# Altium project EVK-NORA-W1.PrjPcb (part 1 of 3)
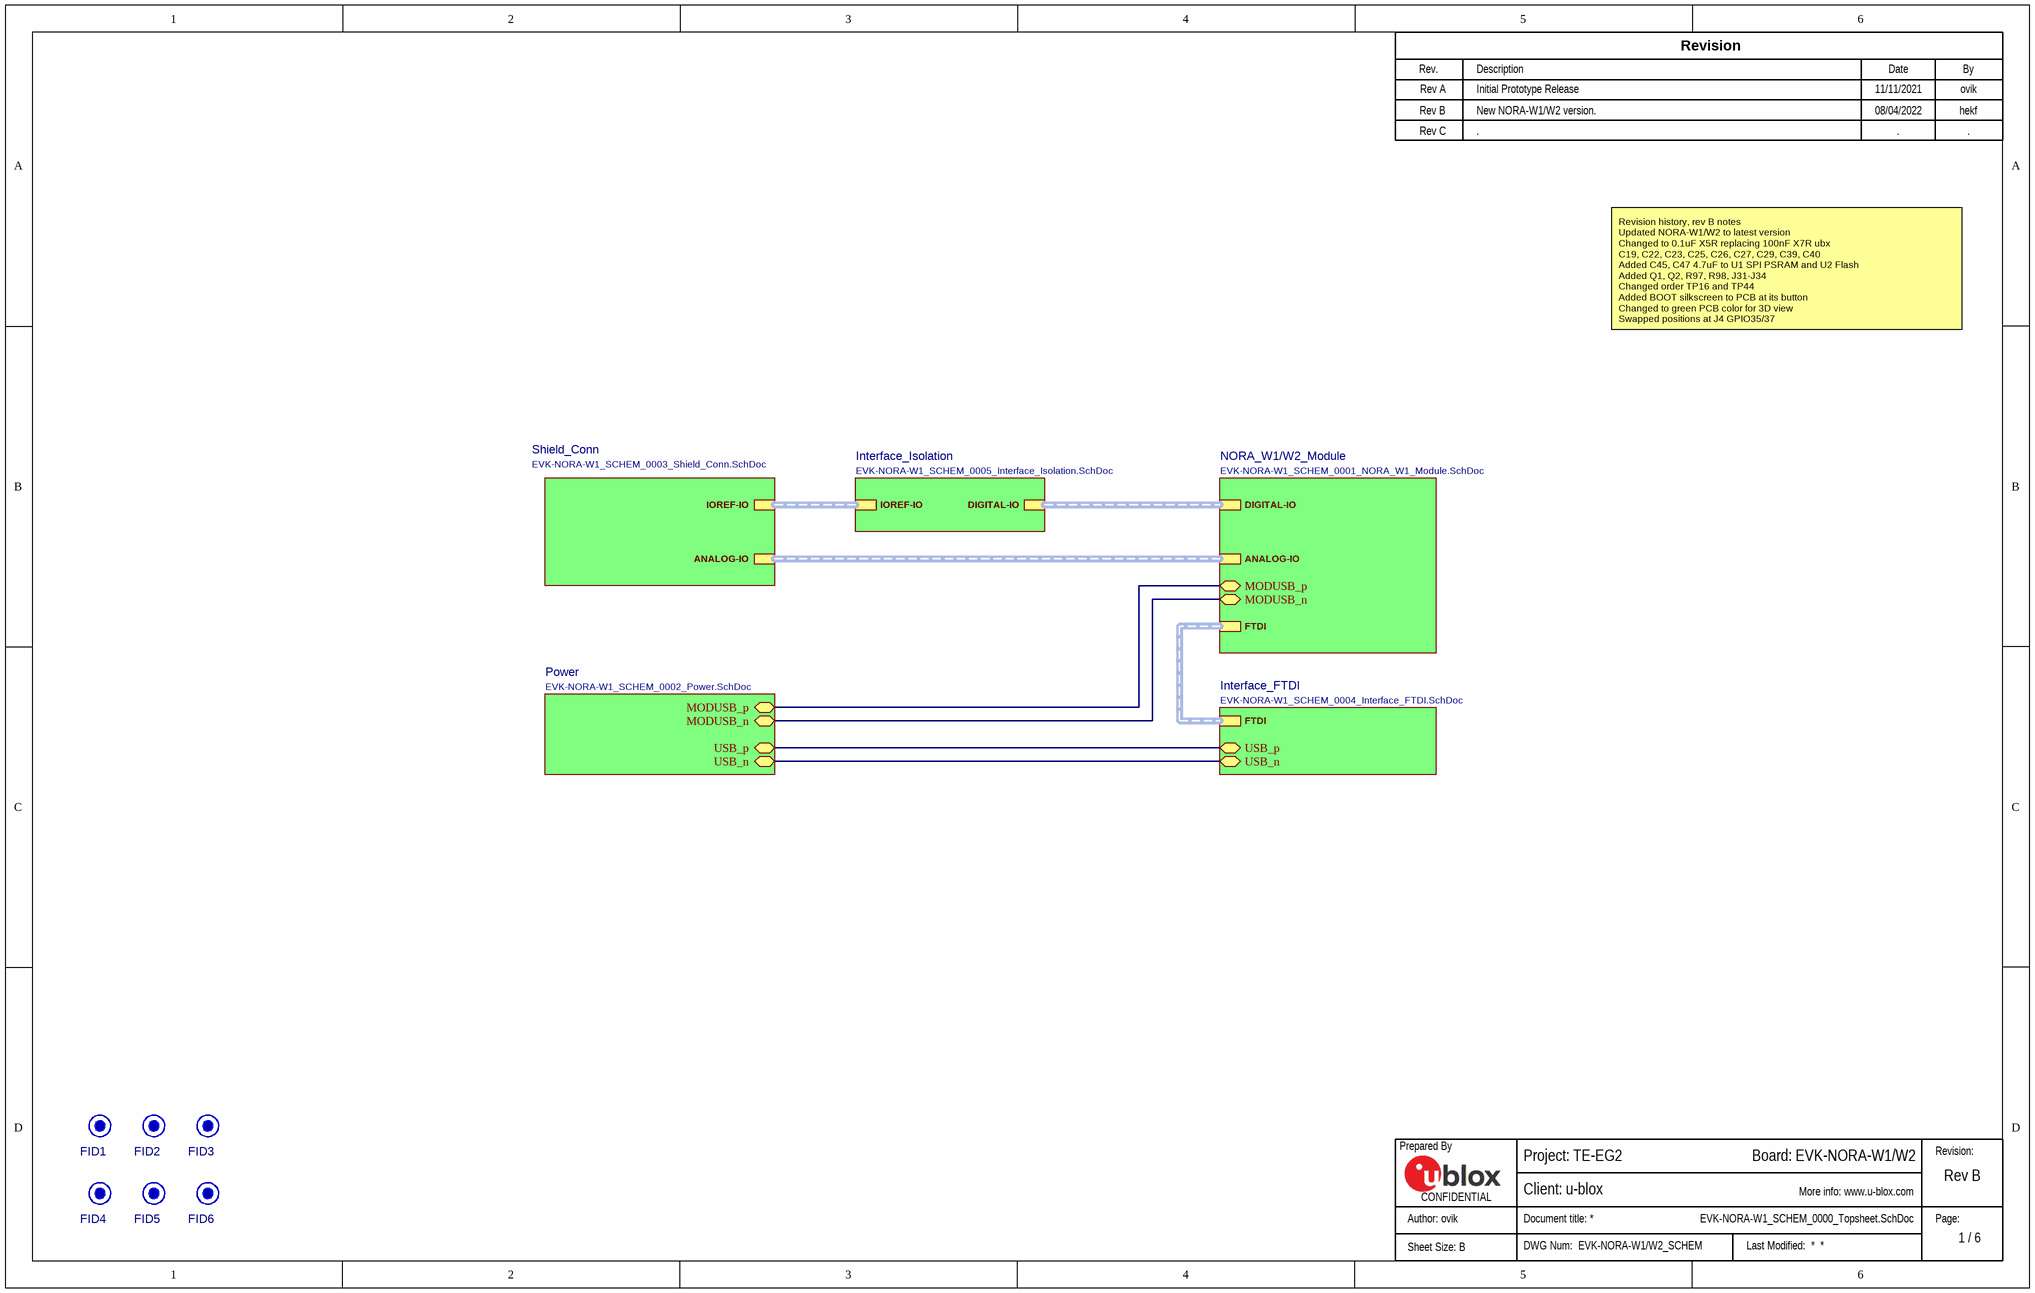
[diagram p0: EVK-NORA-W1_SCHEM_0000_Topsheet.SchDoc]
SchSheetTotal: 6; SchDocNum: EVK-NORA-W1/W2_SCHEM; ReleaseRev5: Rev E; ReleaseRev4: Rev D; ReleaseRev3: Rev C; ReleaseRev2: Rev B; ReleaseRev1: Rev A; ReleaseDesc5: not done; ReleaseDesc4: .; ReleaseDesc3: .; ReleaseDesc2: New NORA-W1/W2 version.; ReleaseDesc1: Initial Prototype Release; ReleaseDate5: .; ReleaseDate4: .; ReleaseDate3: .; ReleaseDate2: 08/04/2022; ReleaseDate1: 11/11/2021; ReleaseBy5: .; ReleaseBy4: .; ReleaseBy3: .; ReleaseBy2: hekf; ReleaseBy1: ovik; ProjectEngineer: ovik; PCBName: EVK-NORA-W1/W2; PCBDocNum: UBXH60-0000895; GlobalReleaseDate: 08/04/2022; GlobalProjectTeam: u-blox AG; GlobalProjectRevision: Rev B; GlobalProjectName: TE-EG2; GlobalProjectLink: www.u-blox.com; GlobalClientName: u-blox
6 sheets, 310 parts. Net scope: flat (ports and power ports of the same name join across sheets).
Board file: EVK-NORA-W1.PcbDoc
Sheets:
  EVK-NORA-W1_SCHEM_0000_Topsheet.SchDoc
    NORA_W1/W2_Module = EVK-NORA-W1_SCHEM_0001_NORA_W1_Module.SchDoc
    Interface_FTDI = EVK-NORA-W1_SCHEM_0004_Interface_FTDI.SchDoc
    Shield_Conn = EVK-NORA-W1_SCHEM_0003_Shield_Conn.SchDoc
    Interface_Isolation = EVK-NORA-W1_SCHEM_0005_Interface_Isolation.SchDoc
    Power = EVK-NORA-W1_SCHEM_0002_Power.SchDoc

## Sheet EVK-NORA-W1_SCHEM_0000_Topsheet.SchDoc
size B; Date: 7/24/2020; CompanyName: U-Blox; DrawnBy: EMOO; Engineer: EMOO; Organization: U-Blox; Address1: 3950 Fairview Industrial Dr SE #100; Address2: Salem, OR 97302; SheetNumber: 1; SheetTotal: 6; SheetSize: B; SheetTitle: TopSheet

### Parts
(Parts that share a designator on the sheet are numbered #1, #2 ... from top to bottom, then left to right.)
?#1  (no value)  (graphical)
?#2  (no value)  (graphical)
FID1  FID  [FIDUCIAL40]  (value not drawn)  (no BOM)
FID2  FID  [FIDUCIAL40]  (value not drawn)  (no BOM)
FID3  FID  [FIDUCIAL40]  (value not drawn)  (no BOM)
FID4  FID  [FIDUCIAL40]  (value not drawn)  (no BOM)
FID5  FID  [FIDUCIAL40]  (value not drawn)  (no BOM)
FID6  FID  [FIDUCIAL40]  (value not drawn)  (no BOM)

### Sub-sheets
Interface_FTDI = EVK-NORA-W1_SCHEM_0004_Interface_FTDI.SchDoc: FTDI (harness FTDI), USB_p (bidir), USB_n (bidir)
Interface_Isolation = EVK-NORA-W1_SCHEM_0005_Interface_Isolation.SchDoc: DIGITAL-IO (harness DIGITAL-IO), IOREF-IO (harness IOREF-IO)
NORA_W1/W2_Module = EVK-NORA-W1_SCHEM_0001_NORA_W1_Module.SchDoc: FTDI (harness FTDI), DIGITAL-IO (harness DIGITAL-IO), ANALOG-IO (harness ANALOG-IO), MODUSB_p (bidir), MODUSB_n (bidir)
Power = EVK-NORA-W1_SCHEM_0002_Power.SchDoc: USB_p (bidir), MODUSB_p (bidir), MODUSB_n (bidir), USB_n (bidir)
Shield_Conn = EVK-NORA-W1_SCHEM_0003_Shield_Conn.SchDoc: IOREF-IO (harness IOREF-IO), ANALOG-IO (harness ANALOG-IO)

### Nets
(unnamed): sheet NORA_W1/W2_Module/MODUSB_p, sheet Power/MODUSB_p
(unnamed): sheet NORA_W1/W2_Module/MODUSB_n, sheet Power/MODUSB_n
(unnamed): sheet Interface_FTDI/USB_p, sheet Power/USB_p
(unnamed): sheet Interface_FTDI/USB_n, sheet Power/USB_n

### Buses and harness runs
harness sheet Interface_FTDI/FTDI = sheet NORA_W1/W2_Module/FTDI
harness sheet Interface_Isolation/DIGITAL-IO = sheet NORA_W1/W2_Module/DIGITAL-IO
harness sheet Interface_Isolation/IOREF-IO = sheet Shield_Conn/IOREF-IO
harness sheet NORA_W1/W2_Module/ANALOG-IO = sheet Shield_Conn/ANALOG-IO

### Notes on the sheet
- Revision history, rev B notes
  Updated NORA-W1/W2 to latest version
  Changed to 0.1uF X5R replacing 100nF X7R ubx
  C19, C22, C23, C25, C26, C27, C29, C39, C40
  Added C45, C47 4.7uF to U1 SPI PSRAM and U2 Flash
  Added Q1, Q2, R97, R98, J31-J34
  Changed order TP16 and TP44
  Added BOOT silkscreen to PCB at its button
  Changed to green PCB color for 3D view
  Swapped positions at J4 GPIO35/37
- Rev.
- Description
- Revision
- Date
- By
- Prepared By
- Revision:
- CONFIDENTIAL
- Page:

### Library data of the parts
?#1 = Top_Revision_Block: Release Revision History Block
?#2 = Top_Title_Block: Top level schematic title block for top level sheet
FID1-FID6 = FIDUCIAL.04: Fiducial, 0.040" inner Dia, 0.075" outer Dia; Added By: Jeremy D; Part Number: FIDUCIAL.04; Size: 0.040"; Height: 0; DNP: DNP; Added Date: 2/1/2015; Checked By: Paul B; Checked Date: 2/5/2015

## Sheet EVK-NORA-W1_SCHEM_0001_NORA_W1_Module.SchDoc: UBX_NORA_B1_SCHEM_0001_NORA_B1_Module
size B; Date: 7/24/2020; CompanyName: U-blox; DrawnBy: EMOO; Engineer: EMOO; Organization: U-blox; Address1: 3950 Fairview Industrial Dr SE #100; Address2: Salem, OR 97302; SheetNumber: 3; SheetTotal: 6; Website: www.u-blox.com; SheetSize: B
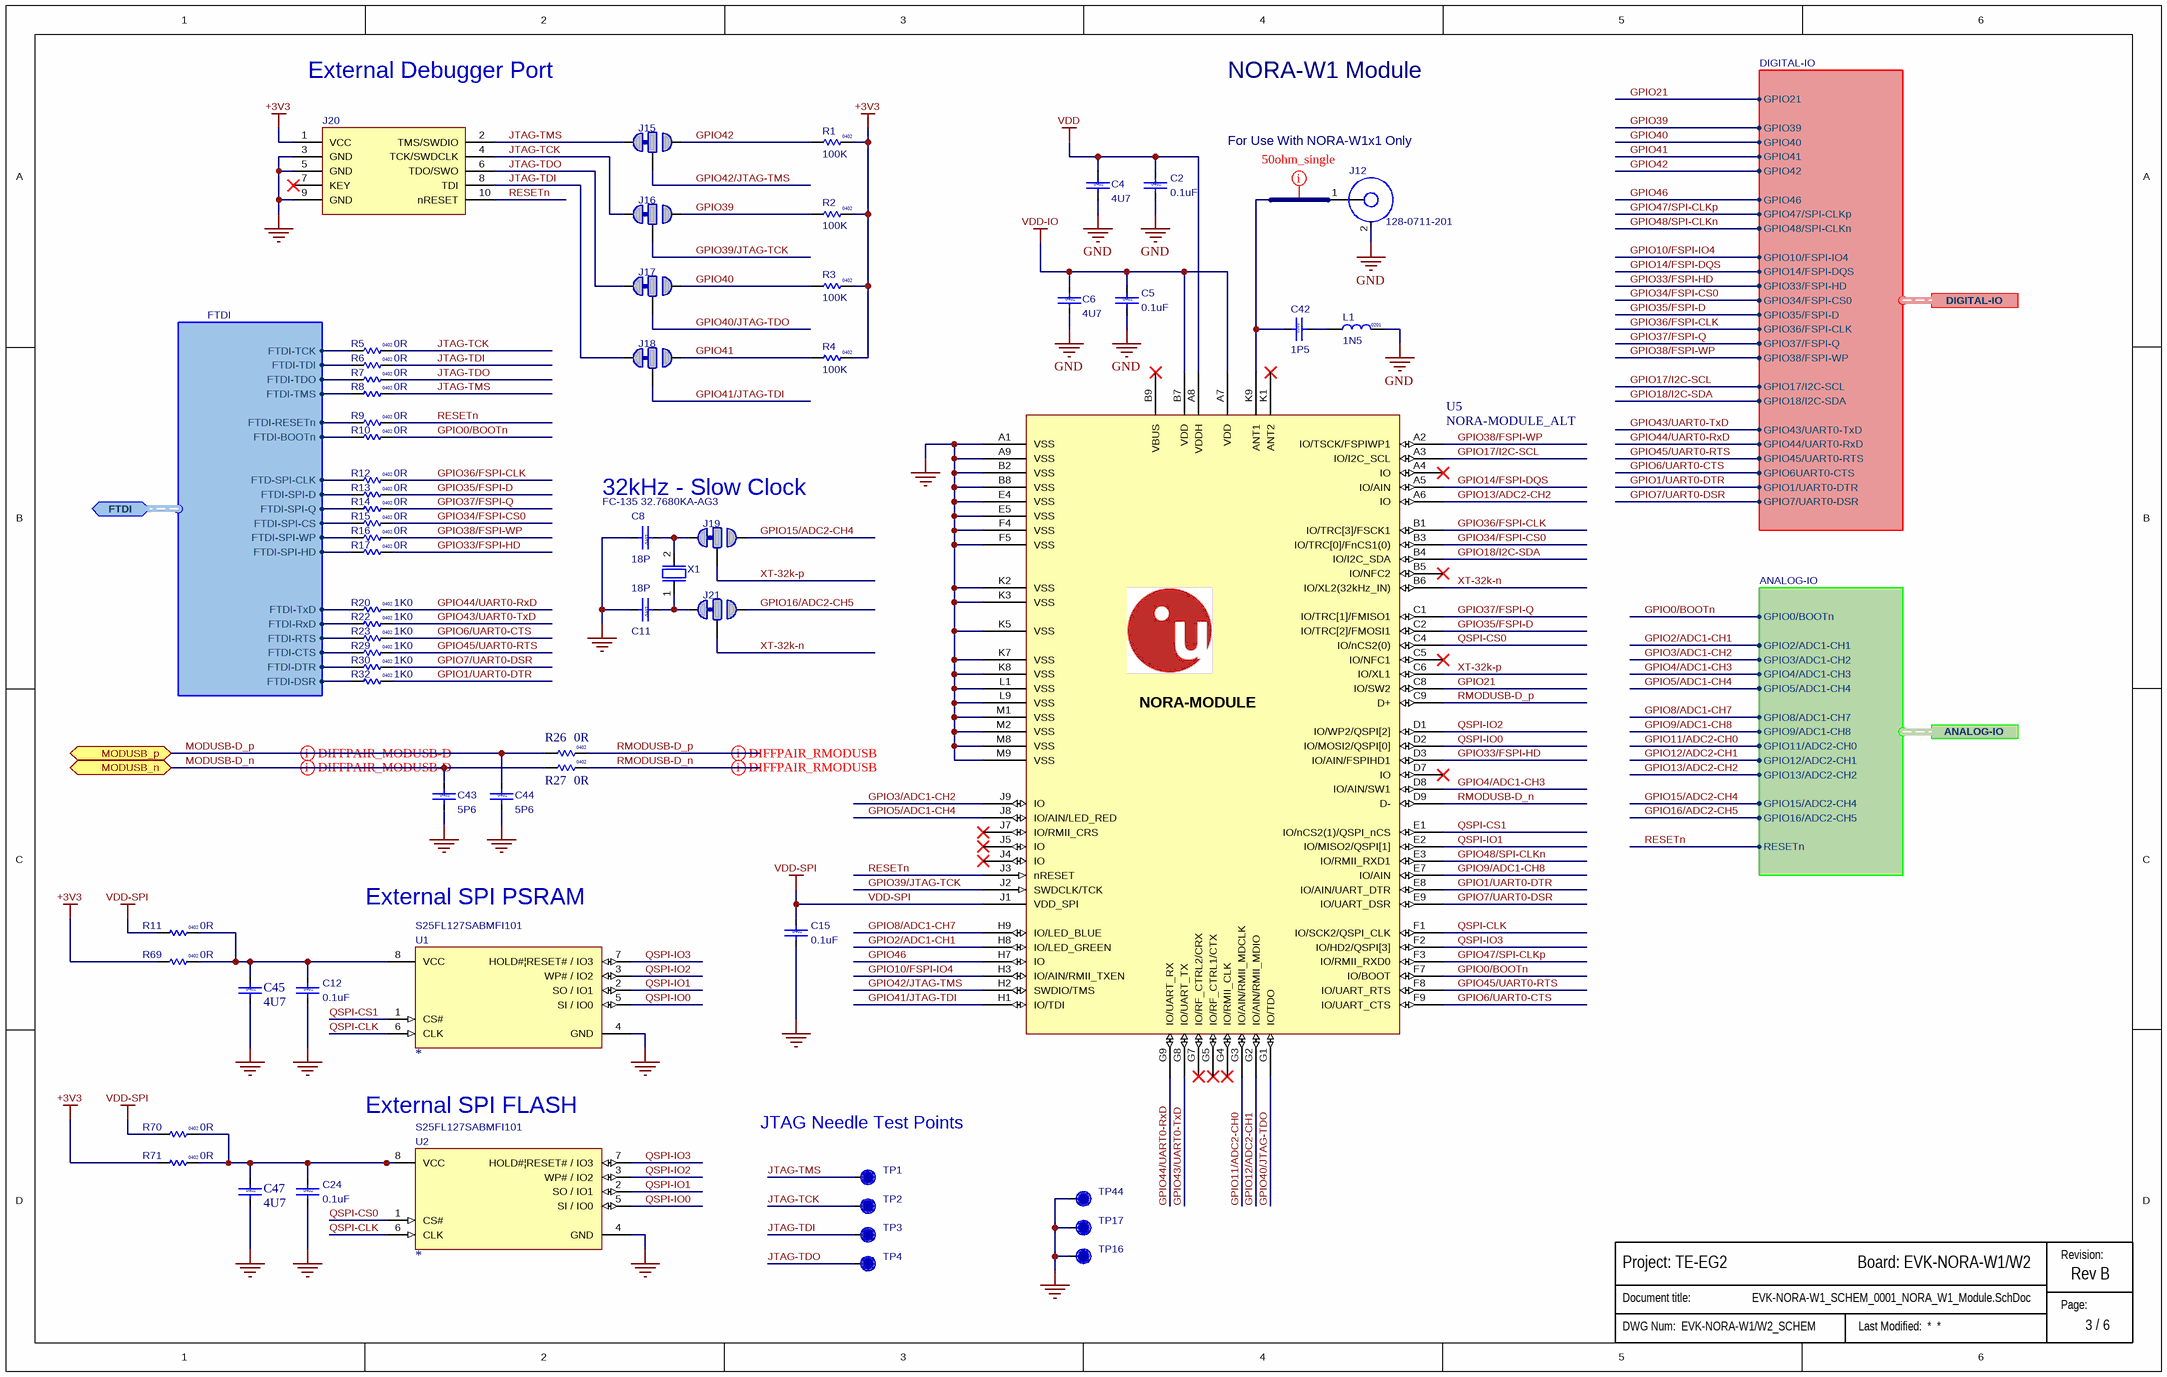
[diagram p1: EVK-NORA-W1_SCHEM_0001_NORA_W1_Module.SchDoc]

### Parts
(Parts that share a designator on the sheet are numbered #1, #2 ... from top to bottom, then left to right.)
?#3  (no value)  (graphical)
C2  value 0.1uF  Size: 0402  [Cap 0402 HD]  (hidden comment: 120-000160.1uF)
C4  value 4U7  Size: 0402  [Cap 0402 HD]
C5  value 0.1uF  Size: 0402  [Cap 0402 HD]  (hidden comment: 120-000160.1uF)
C6  value 4U7  Size: 0402  [Cap 0402 HD]
C8  value 18P  Size: 0402  [Cap 0402]
C11  value 18P  Size: 0402  [Cap 0402]
C12  value 0.1uF  Size: 0402  [Cap 0402 HD]  (hidden comment: 120-000160.1uF)
C15  value 0.1uF  Size: 0402  [Cap 0402 HD]  (hidden comment: 120-000160.1uF)
C24  value 0.1uF  Size: 0402  [Cap 0402 HD]  (hidden comment: 120-000160.1uF)
C42  value 1P5  Size: 0201  [Cap 0201 HD]
C43  value 5P6  Size: 0402  [Cap 0402]
C44  value 5P6  Size: 0402  [Cap 0402]
C45  value 4U7  Size: 0402  [Cap 0402 HD]
C47  value 4U7  Size: 0402  [Cap 0402 HD]
J12  Manufacturer P/N: 128-0711-201  [U.FL_3Pin]
J15  Solderbridge-OptionDNP  [Solderbridge-Option]  (value not drawn)  (net tie, no BOM)
J16  Solderbridge-OptionDNP  [Solderbridge-Option]  (value not drawn)  (net tie, no BOM)
J17  Solderbridge-OptionDNP  [Solderbridge-Option]  (value not drawn)  (net tie, no BOM)
J18  Solderbridge-OptionDNP  [Solderbridge-Option]  (value not drawn)  (net tie, no BOM)
J19  Solderbridge-OptionDNP  [Solderbridge-Option]  (value not drawn)  (net tie, no BOM)
J20  130-00099  [HDR.050P-10Pin-2x5-SMT_Key]  (value not drawn)
J21  Solderbridge-OptionDNP  [Solderbridge-Option]  (value not drawn)  (net tie, no BOM)
L1  value 1N5  Size: 0201  [IND 0201 HD]
R1  value 100K  Size: 0402  [RES 0402 HD]
R2  value 100K  Size: 0402  [RES 0402 HD]
R3  value 100K  Size: 0402  [RES 0402 HD]
R4  value 100K  Size: 0402  [RES 0402 HD]
R5  value 0R  Size: 0402  [RES 0402 HD]
R6  value 0R  Size: 0402  [RES 0402 HD]
R7  value 0R  Size: 0402  [RES 0402 HD]
R8  value 0R  Size: 0402  [RES 0402 HD]
R9  value 0R  Size: 0402  [RES 0402 HD]
R10  value 0R  Size: 0402  [RES 0402 HD]
R11  value 0R  Size: 0402  [RES 0402 HD]
R12  value 0R  Size: 0402  [RES 0402 HD]
R13  value 0R  Size: 0402  [RES 0402 HD]
R14  value 0R  Size: 0402  [RES 0402 HD]
R15  value 0R  Size: 0402  [RES 0402 HD]
R16  value 0R  Size: 0402  [RES 0402 HD]
R17  value 0R  Size: 0402  [RES 0402 HD]
R20  value 1K0  Size: 0402  [RES 0402 HD]
R22  value 1K0  Size: 0402  [RES 0402 HD]
R23  value 1K0  Size: 0402  [RES 0402 HD]
R26  value 0R  Size: 0402  [RES 0402 HD]
R27  value 0R  Size: 0402  [RES 0402 HD]
R29  value 1K0  Size: 0402  [RES 0402 HD]
R30  value 1K0  Size: 0402  [RES 0402 HD]
R32  value 1K0  Size: 0402  [RES 0402 HD]
R69  value 0R  Size: 0402  [RES 0402 HD]
R70  value 0R  Size: 0402  [RES 0402 HD]
R71  value 0R  Size: 0402  [RES 0402 HD]
TP1  TP  [TP10R]  (value not drawn)  (no BOM)
TP2  TP  [TP10R]  (value not drawn)  (no BOM)
TP3  TP  [TP10R]  (value not drawn)  (no BOM)
TP4  TP  [TP10R]  (value not drawn)  (no BOM)
TP16  TP  [TP10R]  (value not drawn)  (no BOM)
TP17  TP  [TP10R]  (value not drawn)  (no BOM)
TP44  TP  [TP10R]  (value not drawn)  (no BOM)
U1  Manufacturer Part Number 1: S25FL127SABMFI101  [SOIC-8W]
U2  Manufacturer Part Number 1: S25FL127SABMFI101  [SOIC-8W]
U5  NORA-MODULE_ALT  [NORA_LGA82R_1430X1040X180_ANT]
X1  Manufacturer P/N: FC-135 32.7680KA-AG3  [XTAL_3215]

### Ports
ANALOG-IO (harness ANALOG-IO), DIGITAL-IO (harness DIGITAL-IO), FTDI (bidir, harness FTDI), MODUSB_n (bidir), MODUSB_p (bidir)

### Harnesses
FTDI: FTDI-TCK, FTDI-TDI, FTDI-TDO, FTDI-TMS, FTDI-RESETn, FTDI-BOOTn, FTD-SPI-CLK, FTDI-SPI-D, FTDI-SPI-Q, FTDI-SPI-CS, FTDI-SPI-WP, FTDI-SPI-HD, FTDI-TxD, FTDI-RxD, FTDI-RTS, FTDI-CTS, FTDI-DTR, FTDI-DSR
ANALOG-IO: GPIO2/ADC1-CH1, GPIO3/ADC1-CH2, GPIO4/ADC1-CH3, GPIO5/ADC1-CH4, GPIO8/ADC1-CH7, GPIO9/ADC1-CH8, GPIO11/ADC2-CH0, GPIO12/ADC2-CH1, GPIO13/ADC2-CH2, GPIO15/ADC2-CH4, GPIO16/ADC2-CH5, GPIO0/BOOTn, RESETn
DIGITAL-IO: GPIO1/UART0-DTR, GPIO6UART0-CTS, GPIO7/UART0-DSR, GPIO10/FSPI-IO4, GPIO14/FSPI-DQS, GPIO17/I2C-SCL, GPIO18/I2C-SDA, GPIO21, GPIO33/FSPI-HD, GPIO34/FSPI-CS0, GPIO35/FSPI-D, GPIO36/FSPI-CLK, GPIO37/FSPI-Q, GPIO38/FSPI-WP, GPIO39, GPIO40, GPIO41, GPIO42, GPIO43/UART0-TxD, GPIO44/UART0-RxD, GPIO45/UART0-RTS, GPIO46, GPIO47/SPI-CLKp, GPIO48/SPI-CLKn

### Nets
+3V3: J20.1(VCC) R1.2 R2.2 R3.2 R4.2 R69.1 R71.1
GND: C2.2 C4.2 C5.2 C6.2 C8.2 C11.2 C12.2 C15.2 C24.2 C43.2 C44.2 C45.2 C47.2 J12.2 J20.3(GND) J20.5(GND) J20.9(GND) L1.2 TP16.1 TP17.1 TP44.1 U1.4(GND) U2.4(GND) U5.A1(VSS) U5.A9(VSS) U5.B2(VSS) U5.B8(VSS) U5.E4(VSS) U5.E5(VSS) U5.F4(VSS) U5.F5(VSS) U5.K2(VSS) U5.K3(VSS) U5.K5(VSS) U5.K7(VSS) U5.K8(VSS) U5.L1(VSS) U5.L9(VSS) U5.M1(VSS) U5.M2(VSS) U5.M8(VSS) U5.M9(VSS)
VDD: C2.1 C4.1 U5.A8(VDDH)
VDD-IO: C5.1 C6.1 U5.A7(VDD) U5.B7(VDD)
VDD-SPI: C15.1 R11.1 R70.1 U5.J1(VDD_SPI)
FTDI-BOOTn: R10.1 ; port FTDI.FTDI-BOOTn
FTDI-CTS: R29.1 ; port FTDI.FTDI-CTS
FTDI-DSR: R32.1 ; port FTDI.FTDI-DSR
FTDI-DTR: R30.1 ; port FTDI.FTDI-DTR
FTDI-RESETn: R9.1 ; port FTDI.FTDI-RESETn
FTDI-RTS: R23.1 ; port FTDI.FTDI-RTS
FTDI-RxD: R22.1 ; port FTDI.FTDI-RxD
FTDI-SPI-CLK: R12.1 ; port FTDI.FTD-SPI-CLK
FTDI-SPI-CS: R15.1 ; port FTDI.FTDI-SPI-CS
FTDI-SPI-D: R13.1 ; port FTDI.FTDI-SPI-D
FTDI-SPI-HD: R17.1 ; port FTDI.FTDI-SPI-HD
FTDI-SPI-Q: R14.1 ; port FTDI.FTDI-SPI-Q
FTDI-SPI-WP: R16.1 ; port FTDI.FTDI-SPI-WP
FTDI-TCK: R5.1 ; port FTDI.FTDI-TCK
FTDI-TDI: R6.1 ; port FTDI.FTDI-TDI
FTDI-TDO: R7.1 ; port FTDI.FTDI-TDO
FTDI-TMS: R8.1 ; port FTDI.FTDI-TMS
FTDI-TxD: R20.1 ; port FTDI.FTDI-TxD
GPIO0/BOOTn: R10.2 U5.F7(IO/BOOT) ; port ANALOG-IO.GPIO0/BOOTn
GPIO1/UART0-DTR: R32.2 U5.E8(IO/AIN/UART_DTR) ; port DIGITAL-IO.GPIO1/UART0-DTR
GPIO2/ADC1-CH1: U5.H8(IO/LED_GREEN) ; port ANALOG-IO.GPIO2/ADC1-CH1
GPIO3/ADC1-CH2: U5.J9(IO) ; port ANALOG-IO.GPIO3/ADC1-CH2
GPIO4/ADC1-CH3: U5.D8(IO/AIN/SW1) ; port ANALOG-IO.GPIO4/ADC1-CH3
GPIO5/ADC1-CH4: U5.J8(IO/AIN/LED_RED) ; port ANALOG-IO.GPIO5/ADC1-CH4
GPIO6/UART0-CTS: R23.2 U5.F9(IO/UART_CTS) ; port DIGITAL-IO.GPIO6UART0-CTS
GPIO7/UART0-DSR: R30.2 U5.E9(IO/UART_DSR) ; port DIGITAL-IO.GPIO7/UART0-DSR
GPIO8/ADC1-CH7: U5.H9(IO/LED_BLUE) ; port ANALOG-IO.GPIO8/ADC1-CH7
GPIO9/ADC1-CH8: U5.E7(IO/AIN) ; port ANALOG-IO.GPIO9/ADC1-CH8
GPIO10/FSPI-IO4: U5.H3(IO/AIN/RMII_TXEN) ; port DIGITAL-IO.GPIO10/FSPI-IO4
GPIO11/ADC2-CH0: U5.G3(IO/AIN/RMII_MDCLK) ; port ANALOG-IO.GPIO11/ADC2-CH0
GPIO12/ADC2-CH1: U5.G2(IO/AIN/RMII_MDIO) ; port ANALOG-IO.GPIO12/ADC2-CH1
GPIO13/ADC2-CH2: U5.A6(IO) ; port ANALOG-IO.GPIO13/ADC2-CH2
GPIO14/FSPI-DQS: U5.A5(IO/AIN) ; port DIGITAL-IO.GPIO14/FSPI-DQS
GPIO15/ADC2-CH4: J19.3 ; port ANALOG-IO.GPIO15/ADC2-CH4
GPIO16/ADC2-CH5: J21.3 ; port ANALOG-IO.GPIO16/ADC2-CH5
GPIO17/I2C-SCL: U5.A3(IO/I2C_SCL) ; port DIGITAL-IO.GPIO17/I2C-SCL
GPIO18/I2C-SDA: U5.B4(IO/I2C_SDA) ; port DIGITAL-IO.GPIO18/I2C-SDA
GPIO21: U5.C8(IO/SW2) ; port DIGITAL-IO.GPIO21
GPIO33/FSPI-HD: R17.2 U5.D3(IO/AIN/FSPIHD1) ; port DIGITAL-IO.GPIO33/FSPI-HD
GPIO34/FSPI-CS0: R15.2 U5.B3(IO/TRC[0]/FnCS1(0)) ; port DIGITAL-IO.GPIO34/FSPI-CS0
GPIO35/FSPI-D: R13.2 U5.C2(IO/TRC[2]/FMOSI1) ; port DIGITAL-IO.GPIO35/FSPI-D
GPIO36/FSPI-CLK: R12.2 U5.B1(IO/TRC[3]/FSCK1) ; port DIGITAL-IO.GPIO36/FSPI-CLK
GPIO37/FSPI-Q: R14.2 U5.C1(IO/TRC[1]/FMISO1) ; port DIGITAL-IO.GPIO37/FSPI-Q
GPIO38/FSPI-WP: R16.2 U5.A2(IO/TSCK/FSPIWP1) ; port DIGITAL-IO.GPIO38/FSPI-WP
GPIO39: J16.3 R2.1 ; port DIGITAL-IO.GPIO39
GPIO39/JTAG-TCK: J16.2 U5.J2(SWDCLK/TCK)
GPIO40: J17.3 R3.1 ; port DIGITAL-IO.GPIO40
GPIO40/JTAG-TDO: J17.2 U5.G1(IO/TDO)
GPIO41: J18.3 R4.1 ; port DIGITAL-IO.GPIO41
GPIO41/JTAG-TDI: J18.2 U5.H1(IO/TDI)
GPIO42: J15.3 R1.1 ; port DIGITAL-IO.GPIO42
GPIO42/JTAG-TMS: J15.2 U5.H2(SWDIO/TMS)
GPIO43/UART0-TxD: R22.2 U5.G8(IO/UART_TX) ; port DIGITAL-IO.GPIO43/UART0-TxD
GPIO44/UART0-RxD: R20.2 U5.G9(IO/UART_RX) ; port DIGITAL-IO.GPIO44/UART0-RxD
GPIO45/UART0-RTS: R29.2 U5.F8(IO/UART_RTS) ; port DIGITAL-IO.GPIO45/UART0-RTS
GPIO46: U5.H7(IO) ; port DIGITAL-IO.GPIO46
GPIO47/SPI-CLKp: U5.F3(IO/RMII_RXD0) ; port DIGITAL-IO.GPIO47/SPI-CLKp
GPIO48/SPI-CLKn: U5.E3(IO/RMII_RXD1) ; port DIGITAL-IO.GPIO48/SPI-CLKn
JTAG-TCK: J16.1 J20.4(TCK/SWDCLK) R5.2 TP2.1
JTAG-TDI: J18.1 J20.8(TDI) R6.2 TP3.1
JTAG-TDO: J17.1 J20.6(TDO/SWO) R7.2 TP4.1
JTAG-TMS: J15.1 J20.2(TMS/SWDIO) R8.2 TP1.1
MODUSB-D_n: C43.1 R27.1 ; port MODUSB_n
MODUSB-D_p: C44.1 R26.1 ; port MODUSB_p
QSPI-CLK: U1.6(CLK) U2.6(CLK) U5.F1(IO/SCK2/QSPI_CLK)
QSPI-CS0: U2.1(CS#) U5.C4(IO/nCS2(0))
QSPI-CS1: U1.1(CS#) U5.E1(IO/nCS2(1)/QSPI_nCS)
QSPI-IO0: U1.5(SI_/_IO0) U2.5(SI_/_IO0) U5.D2(IO/MOSI2/QSPI[0])
QSPI-IO1: U1.2(SO_/_IO1) U2.2(SO_/_IO1) U5.E2(IO/MISO2/QSPI[1])
QSPI-IO2: U1.3(WP#_/_IO2) U2.3(WP#_/_IO2) U5.D1(IO/WP2/QSPI[2])
QSPI-IO3: U1.7(HOLD#|RESET#_/_IO3) U2.7(HOLD#|RESET#_/_IO3) U5.F2(IO/HD2/QSPI[3])
RESETn: J20.10(nRESET) R9.2 U5.J3(nRESET) ; port ANALOG-IO.RESETn
RMODUSB-D_n: R27.2 U5.D9(D-)
RMODUSB-D_p: R26.2 U5.C9(D+)
XT-32k-n: J21.2 U5.B6(IO/XL2(32kHz_IN))
XT-32k-p: J19.2 U5.C6(IO/XL1)
NetC8_1: C8.1 J19.1 X1.2
NetC11_1: C11.1 J21.1 X1.1
NetC12_1: C12.1 C45.1 R11.2 R69.2 U1.8(VCC)
NetC24_1: C24.1 C47.1 R70.2 R71.2 U2.8(VCC)
NetC42_1: C42.1 J12.1(ANT) U5.K9(ANT1)
NetC42_2: C42.2 L1.1

Not connected (* = marked no-connect by the designer): J20 7(KEY)*; U5 A4(IO)* B5(IO/NFC2)* B9(VBUS)* C5(IO/NFC1)* D7(IO)* G4(IO/RMII_CLK)* G5(IO/RF_CTRL1/CTX)* G7(IO/RF_CTRL2/CRX)* J4(IO)* J5(IO)* J7(IO/RMII_CRS)* K1(ANT2)*

### Layout directives
differential pair; net class USB_DIFF: MODUSB-D_n, MODUSB-D_p, RMODUSB-D_n, RMODUSB-D_p
net class 50_ohm_se: NetC42_1

### Notes on the sheet
- External Debugger Port
- NORA-W1 Module
- For Use With NORA-W1x1 Only
- 32kHz - Slow Clock
- (near U1) External SPI PSRAM
- External SPI FLASH
- (near TP1) JTAG Needle Test Points
- Revision:
- Page:
- (in symbol NORA-MODULE_ALT) NORA-MODULE

### Library data of the parts
?#3 = Sub_Title_Block: Minimized schematic title block for all subset sheets
C2 C5 C12 C15 C24 = 120-00016: Cap, Ceramic 0.1uF 10V 10% X5R 0402; Part Name: CAP CER 0.1UF 10V 10% X5R 0402; Part_Type: Ceramic Capacitor; Manufacturer: Murata Electronics North America; Manufacturer P/N: GRM155R61A104KA01J; Item_Phase: Production; Component Mounting Type: SMT; Tolerance: +/- 10%; Use in new designs: Yes; Part Number: 120-00016; Revision: 0A; Supplier 1: Digi-Key; Supplier Part Number 1: 490-6297-1-ND; Manufacturer 2: Yageo; Manufacturer P/N 2: CC0402KRX5R6BB104; Supplier 2: Digi-Key; Supplier Part Number 2: 311-1336-1-ND; Arena Link: https://app.bom.com/a/GYHPV2L2L43KRMBK?v=spec.summary; Height: 0.55mm; Pins: 2; Temperature Coefficient: X5R; Voltage: 10V
C4 C6 C45 C47 = UBXH01-0000243: CAP CER X5R 0402 4U7 20% 10V; Manufacturer: Murata Manufacturing Company, Ltd.; Manufacturer P/N: GRM155R61A475MEAA; Editor: martin.pilik; Released by: fabrice.bret-dibat; Env: GREEN; Permitted Use: Volume Products; Perferred: PREF; Mfg P/N Status: Active; Mfg P/N Split: 100; Mfg P/N Released: Yes; Part Number: UBXH01-0000243; Tolerance: 20%; Max Voltage: 10V; Min Operating Temp: -40°C; Max Operating Temp: 85°C; Part Type: Capacitor; Release Data: 2021-05-10 12:57:47.325652; UBX Wiki: https://wiki.u-blox.com/bin/view/Operations/PartDetails?index=24303; RefDes: C; Mfg P/N Datasheet: https://wiki.u-blox.com/bin/view/Generic/Docs/DocumentSummary?index=24302
C8 C11 = UBXH01-0004017: CAP CER C0G 0402 18P 5% 25V; Manufacturer: Murata Manufacturing Company, Ltd.; Manufacturer P/N: GRM1555C1H180JA01; Editor: doris.zahnd; Released by: daniel.hurni; Env: ROHS; Permitted Use: Volume Products; Perferred: PREF; Mfg P/N Status: NRND; Mfg P/N Split: 100; Mfg P/N Released: Yes; Part Number: UBXH01-0004017; Tolerance: 5%; Max Voltage: 25V; Min Operating Temp: -55°C; Max Operating Temp: 125°C; Part Type: Capacitor; Release Data: 2009-12-03 17:48:42.813059; UBX Wiki: https://wiki.u-blox.com/bin/view/Operations/PartDetails?index=5178; RefDes: C; Manufacturer 2: Murata Manufacturing Company, Ltd.; Manufacturer P/N 2: GRM1555C1E180JZ01; Mfg P/N Status 2: Obsolete; Mfg P/N Split 2: 0; Mfg P/N Released 2: Yes; Manufacturer 3: Murata Manufacturing Company, Ltd.; Manufacturer P/N 3: GRM1555C1H180JZ01; Mfg P/N Status 3: Obsolete; Mfg P/N Split 3: 0; Mfg P/N Released 3: Yes
C42 = UBXH01-0012002: CAP CER C0G 0201 1P5 +/-0.25P 25V; Manufacturer: Murata Manufacturing Company, Ltd.; Manufacturer P/N: GRM0335C1E1R5CA01; Editor: roland.rust; Env: ROHS; Permitted Use: Volume Products; Perferred: PREF; Mfg P/N Status: Active; Mfg P/N Split: 100; Mfg P/N Released: Yes; Part Number: UBXH01-0012002; Tolerance: +/-0.25P; Max Voltage: 25V; Part Type: Capacitor; Released by: roland.rust; Release Data: 2009-03-23T10:34:14; UBX Wiki: https://wiki.u-blox.com/bin/view/Operations/PartDetails?index=5072; RefDes: C; Manufacturer 2: Murata Manufacturing Company, Ltd.; Manufacturer P/N 2: GRM0335C1E1R5C; Mfg P/N Status 2: Active; Mfg P/N Split 2: 0; Mfg P/N Released 2: Obsolete
C43 C44 = UBXH01-0004011: CAP CER C0G 0402 5P6 +/-0.25P 25V; Manufacturer: Murata Manufacturing Company, Ltd.; Manufacturer P/N: GRM1555C1H5R6CZ01; Editor: roland.rust; Env: ROHS; Permitted Use: Volume Products; Perferred: PREF; Mfg P/N Status: Obsolete; Mfg P/N Split: 0; Part Number: UBXH01-0004011; Tolerance: +/-0.25P; Max Voltage: 25V; Part Type: Capacitor; Released by: roland.rust; Release Data: 2007-10-22T12:46:36; UBX Wiki: https://wiki.u-blox.com/bin/view/Operations/PartDetails?index=5160; RefDes: C; Mfg P/N Released: Obsolete; Manufacturer 2: Murata Manufacturing Company, Ltd.; Manufacturer P/N 2: GRM1555C1E5R6CZ01; Mfg P/N Status 2: Obsolete; Mfg P/N Split 2: 0; Mfg P/N Released 2: Obsolete
J12 = 130-00067: U.FL jack, SMA 50 ohm, 3 pin, SMT; Part Name: CON RF UMC U.FL Jack 3Pin SMT; Part_Type: Connector; Manufacturer: Cinch Connectivity; Item_Phase: Production; Connector Type: Coax; Locking: Yes; Rows: 1; Part Number: 130-00067; Revision: 0A; Supplier 1: Digi-Key; Supplier Part Number 1: J983CT-ND; Manufacturer 2: Hirose Electric Co Ltd; Manufacturer P/N 2: U.FL-R-SMT(10); Supplier 2: Digi-Key; Supplier Part Number 2: H9161CT-ND; Arena Link: https://app.bom.com/a/7P8GMTCTCVUARF2N?v=spec.summary; Color: Silver; Component Mounting Type: SMT; Height: 1.25mm; Length: 3mm; Pin Pitch: N/A; Pins: 3; Use in new designs: Yes; Width: 3.1mm
J15-J19 J21 = Solderbridge-Option: Added By: Paul B; Part Number: Solderbridge-Option; Height: 0; DNP: DNP; Added Date: 12/3/2015
J20 = 130-00099: Header 0.05" 10Pin 2Row SMD Black; Part Name: CON HDR 0.05" 10Pin 2Row SMD Black; Part_Type: Connector; Manufacturer: Samtec; Manufacturer P/N: FTSH-105-01-F-DV-K; Item_Phase: Pre-Production; Component Mounting Type: SMT; Keyed: Yes; Locking: No; Pin Pitch: 0.050"; Rows: 2; Part Number: 130-00099; Revision: 1; Supplier 1: Digi-Key; Supplier Part Number 1: SAM8796-ND; Arena Link: https://app.bom.com/a/5N6EKRARATS7TSHL?v=spec.summary; Color: Black; Connector Type: Header; Height: 6mm; Length: 12.75mm; Pins: 10; Use in new designs: Yes; Width: 4.78
L1 = UBXH09-0000030: IND MURATA LQP03T_02 0201 1N5 +/-0.1N 600mA; Manufacturer: Murata Manufacturing Company, Ltd.; Manufacturer P/N: LQP03TN1N5B02; Editor: massimo.pros; Released by: massimo.vlacci; Env: ROHS; Permitted Use: Volume Products; Perferred: PREF; Mfg P/N Status: Active; Mfg P/N Split: 100; Mfg P/N Released: Yes; Part Number: UBXH09-0000030; Tolerance: +/-0.1N; Max Current: 600mA; Part Type: Inductor; Release Data: 2011-06-21T11:29:10; UBX Wiki: https://wiki.u-blox.com/bin/view/Operations/PartDetails?index=13044; RefDes: L; Mfg P/N Datasheet: https://wiki.u-blox.com/bin/view/Generic/Docs/DocumentSummary?index=11499
R1-R4 = UBXH18-0008097: RES THICK FILM CHIP 0402 100K 5% 100mW; Manufacturer: YAGEO; Manufacturer P/N: 2322_705_70104_L; Editor: roland.rust; Env: ROHS; Permitted Use: Volume Products; Perferred: PREF; Mfg P/N Status: NRND; Mfg P/N Split: 100; Mfg P/N Released: Yes; Part Number: UBXH18-0008097; Tolerance: 5%; Max Power: 100mW; Part Type: Resistor; Released by: roland.rust; Release Data: 2005-07-22 13:59:44; UBX Wiki: https://wiki.u-blox.com/bin/view/Operations/PartDetails?index=7020; RefDes: R; Manufacturer 2: KOA; Manufacturer P/N 2: RK73B1ETTD104J; Mfg P/N Status 2: NRND; Mfg P/N Split 2: 0; Mfg P/N Released 2: Yes
R5-R17 R26 R27 R69-R71 = UBXH18-0003002: RES THICK FILM CHIP 0402 0R 0 100mW; Manufacturer: KOA; Manufacturer P/N: RK73Z1ETTD; Tolerance: 0; Editor: charlotte.biber; Released by: peter.mueller; Env: ROHS; Permitted Use: Volume Products; Perferred: PREF; Mfg P/N Status: NRND; Mfg P/N Split: 100; Mfg P/N Released: Yes; Part Number: UBXH18-0003002; Max Power: 100mW; Part Type: Resistor; Release Data: 2012-06-05 09:49:55.978616; UBX Wiki: https://wiki.u-blox.com/bin/view/Operations/PartDetails?index=6611; RefDes: R; Manufacturer 2: YAGEO; Manufacturer P/N 2: 2322_705_91001_L; Mfg P/N Status 2: NRND; Mfg P/N Split 2: 0; Mfg P/N Released 2: Yes
R20 R22 R23 R29 R30 R32 = UBXH18-0008049: RES THICK FILM CHIP 0402 1K0 5% 100mW; Manufacturer: YAGEO; Manufacturer P/N: 2322_705_70102_L; Editor: roland.rust; Env: ROHS; Permitted Use: Volume Products; Perferred: PREF; Mfg P/N Status: NRND; Mfg P/N Split: 100; Mfg P/N Released: Yes; Part Number: UBXH18-0008049; Tolerance: 5%; Max Power: 100mW; Part Type: Resistor; Released by: roland.rust; Release Data: 2005-07-22 13:59:44; UBX Wiki: https://wiki.u-blox.com/bin/view/Operations/PartDetails?index=6939; RefDes: R; Manufacturer 2: KOA; Manufacturer P/N 2: RK73B1ETTD102J; Mfg P/N Status 2: NRND; Mfg P/N Split 2: 0; Mfg P/N Released 2: Yes
TP1-TP4 TP16 TP17 TP44 = TP10R: Testpoint, Round 1.0mm Dia; Added By: Jeremy D; Part Number: TP10R; Size: 1.0mm; Height: 0; DNP: DNP; Added Date: 2/1/2015; Checked By: Paul B; Checked Date: 2/5/2015
U1 U2 = 240-00017: IC, Flash 128MBIT, 108MHz, 8SOIC; Manufacturer 1: Cypress Semiconductor Corp; Part Name: IC Flash 128MBIT 108MHz 8SOIC; Body Size: 5.28mm x 5.28mm; Interface: SPI; Item Phase: Unreleased; Memory Type: Flash - NOR; MFG Package: 8-SOIC; SMT Pitch: 1.27mm; Thermal Pad: No; Use in new designs: Yes; Voltage: 3.6V; UBX Code: None; Manufacturer P/N: *; Part Number: 240-00017; Supplier 1: Digi-Key; Supplier Part Number 1: 1274-1045-ND; Height: 2.16mm; Memory Size: 128Mbit; Memory Speed: 108MHz; Max Operating Temp: 85; Min Operating Temp: -40; Pins: 8; Revision: None; Manufacturer 2: None; Manufacturer Part Number 2: None; Supplier 2: None; Supplier Part Number 2: None
U5 = NORA-MODULE_ALT: u-blox NORA module generic symbol for use within module designs - alternate version; Part Description: NORA MODULE FOOTPRINT; Body Size: 14.3 mm x 10.4 mm; Manufacturer P/N: NORA; Part Number: NORA; Part Name: NORA; Part_Type: Module; Manufacturer: u-blox; Height: 0; Value: NORA
X1 = 100-00005: XTAL, 2Pin, 32.768kHz, 7pF 20ppm; Part Name: XTAL 32.768kHz 7pF 20ppm 3215; Part_Type: Crystal/Oscillator; Manufacturer: Epson; Item_Phase: Production; Body Size: 3.2mm x 1.5mm; Component Mounting Type: SMT; MFG Package: 2-SMD; Use in new designs: Yes; Part Number: 100-00005; Revision: 0C; Supplier 1: Digi-Key; Supplier Part Number 1: SER4086CT-ND; Manufacturer 2: AVX Corporation; Manufacturer P/N 2: ST3215SB32768C0HPWBB; Supplier 2: Digi-Key; Supplier Part Number 2: 1253-1113-1-ND; Arena Link: https://app.bom.com/a/L3MU07Q7Q98O5PC8?v=spec.summary; CL: 7pF; Frequency: 32.768kHz; Frequency Tolerance: 20ppm; Height: 0.9mm; Pins: 2

## Sheet EVK-NORA-W1_SCHEM_0004_Interface_FTDI.SchDoc
size B; Date: 7/24/2020; CompanyName: U-blox; DrawnBy: EMOO; Engineer: EMOO; Organization: U-blox; Address1: 3950 Fairview Industrial Dr SE #100; Address2: Salem, OR 97302; SheetNumber: 6; SheetTotal: 6; SheetSize: B; SheetTitle: Interface MCU
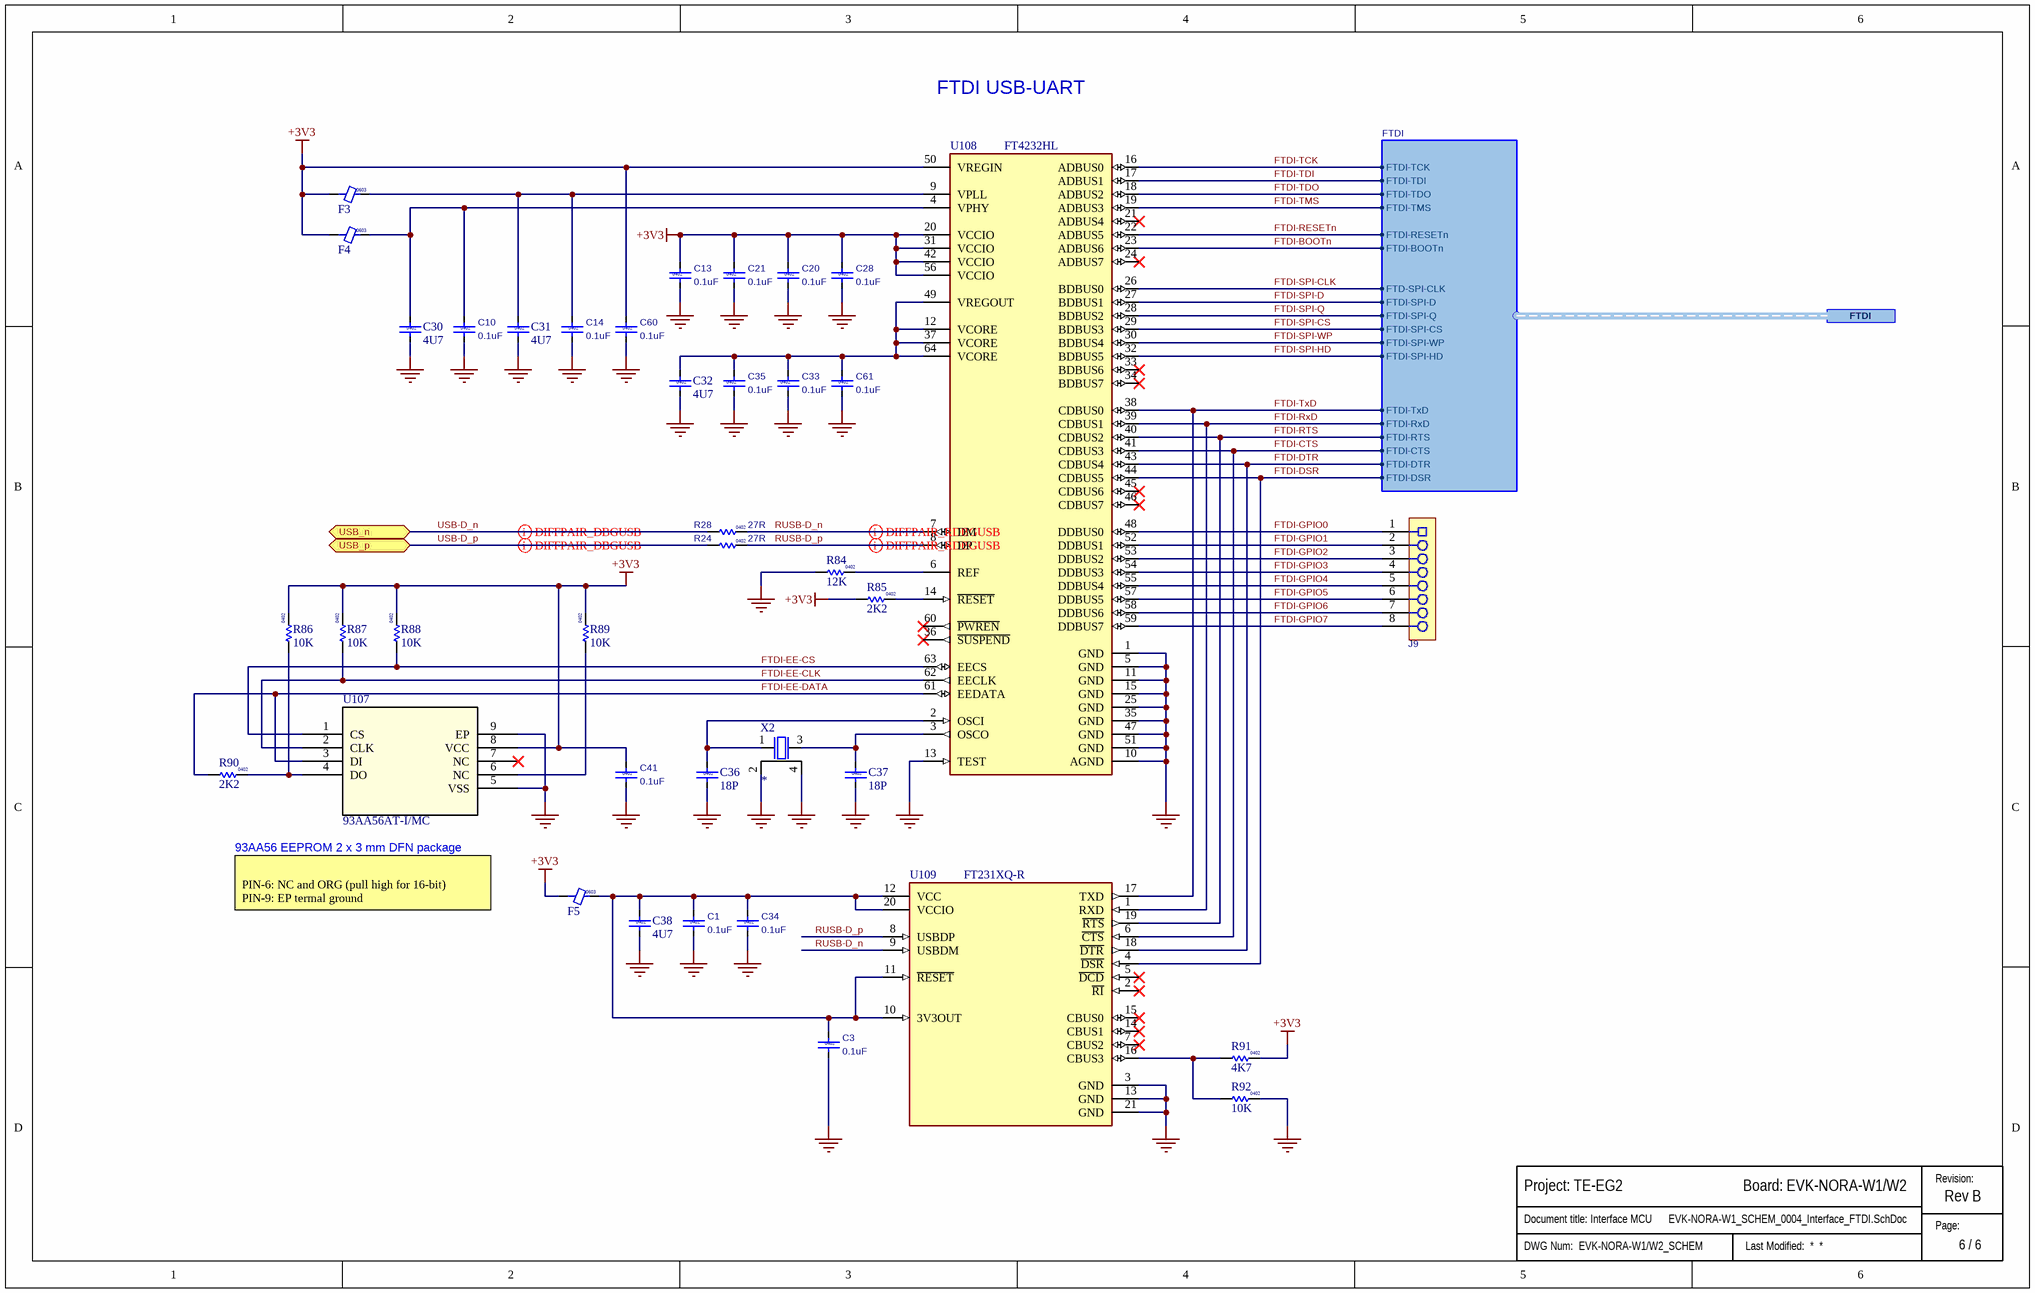
[diagram p2: EVK-NORA-W1_SCHEM_0004_Interface_FTDI.SchDoc]

### Parts
(Parts that share a designator on the sheet are numbered #1, #2 ... from top to bottom, then left to right.)
?#4  (no value)  (graphical)
C1  value 0.1uF  Size: 0402  [Cap 0402 HD]  (hidden comment: 120-000160.1uF)
C3  value 0.1uF  Size: 0402  [Cap 0402 HD]  (hidden comment: 120-000160.1uF)
C10  value 0.1uF  Size: 0402  [Cap 0402 HD]  (hidden comment: 120-000160.1uF)
C13  value 0.1uF  Size: 0402  [Cap 0402 HD]  (hidden comment: 120-000160.1uF)
C14  value 0.1uF  Size: 0402  [Cap 0402 HD]  (hidden comment: 120-000160.1uF)
C20  value 0.1uF  Size: 0402  [Cap 0402 HD]  (hidden comment: 120-000160.1uF)
C21  value 0.1uF  Size: 0402  [Cap 0402 HD]  (hidden comment: 120-000160.1uF)
C28  value 0.1uF  Size: 0402  [Cap 0402 HD]  (hidden comment: 120-000160.1uF)
C30  value 4U7  Size: 0402  [Cap 0402 HD]
C31  value 4U7  Size: 0402  [Cap 0402 HD]
C32  value 4U7  Size: 0402  [Cap 0402 HD]
C33  value 0.1uF  Size: 0402  [Cap 0402 HD]  (hidden comment: 120-000160.1uF)
C34  value 0.1uF  Size: 0402  [Cap 0402 HD]  (hidden comment: 120-000160.1uF)
C35  value 0.1uF  Size: 0402  [Cap 0402 HD]  (hidden comment: 120-000160.1uF)
C36  value 18P  Size: 0402  [Cap 0402]
C37  value 18P  Size: 0402  [Cap 0402]
C38  value 4U7  Size: 0402  [Cap 0402 HD]
C41  value 0.1uF  Size: 0402  [Cap 0402 HD]  (hidden comment: 120-000160.1uF)
C60  value 0.1uF  Size: 0402  [Cap 0402 HD]  (hidden comment: 120-000160.1uF)
C61  value 0.1uF  Size: 0402  [Cap 0402 HD]  (hidden comment: 120-000160.1uF)
F3  Size: 0603  [IND 0603 HD]
F4  Size: 0603  [IND 0603 HD]
F5  Size: 0603  [IND 0603 HD]
J9  (no value)  [SKT-0.1P-SSM-108-L-SV]
R24  value 27R  Size: 0402  [RES 0402 HD]
R28  value 27R  Size: 0402  [RES 0402 HD]
R84  value 12K  Size: 0402  [RES 0402 HD]
R85  value 2K2  Size: 0402  [RES 0402 HD]
R86  value 10K  Size: 0402  [RES 0402 HD]
R87  value 10K  Size: 0402  [RES 0402 HD]
R88  value 10K  Size: 0402  [RES 0402 HD]
R89  value 10K  Size: 0402  [RES 0402 HD]
R90  value 2K2  Size: 0402  [RES 0402 HD]
R91  value 4K7  Size: 0402  [RES 0402 HD]
R92  value 10K  Size: 0402  [RES 0402 HD]
U107  93AA56AT-I/MC  [DFN0.5P-8Pin_W-Pad]
U108  FT4232HL  [QFP0.5P16x16-64Pin_HD]
U109  FT231XQ-R  [QFN_5x5_FT231XQ]
X2  (no value)  [XTAL_3225]

### Ports
FTDI (harness FTDI), USB_n (bidir), USB_p (bidir)

### Harnesses
FTDI: FTDI-TCK, FTDI-TDI, FTDI-TDO, FTDI-TMS, FTDI-RESETn, FTDI-BOOTn, FTD-SPI-CLK, FTDI-SPI-D, FTDI-SPI-Q, FTDI-SPI-CS, FTDI-SPI-WP, FTDI-SPI-HD, FTDI-TxD, FTDI-RxD, FTDI-RTS, FTDI-CTS, FTDI-DTR, FTDI-DSR

### Nets
+3V3: C13.1 C20.1 C21.1 C28.1 C41.1 C60.1 F3.1 F4.1 F5.1 R85.1 R86.2 R87.2 R88.2 R89.2 R91.2 U107.8(VCC) U108.20(VCCIO) U108.31(VCCIO) U108.42(VCCIO) U108.50(VREGIN) U108.56(VCCIO)
GND: C1.2 C3.2 C10.2 C13.2 C14.2 C20.2 C21.2 C28.2 C30.2 C31.2 C32.2 C33.2 C34.2 C35.2 C36.2 C37.2 C38.2 C41.2 C60.2 C61.2 R84.1 R92.2 U107.5(VSS) U107.9(EP) U108.1(GND) U108.5(GND) U108.10(AGND) U108.11(GND) U108.13(TEST) U108.15(GND) U108.25(GND) U108.35(GND) U108.47(GND) U108.51(GND) U109.3(GND) U109.13(GND) U109.21(GND) X2.2 X2.4
FTDI-BOOTn: U108.23(ADBUS6) ; port FTDI.FTDI-BOOTn
FTDI-CTS: U108.41(CDBUS3) U109.6(~{CTS}) ; port FTDI.FTDI-CTS
FTDI-DSR: U108.44(CDBUS5) U109.4(~{DSR}) ; port FTDI.FTDI-DSR
FTDI-DTR: U108.43(CDBUS4) U109.18(~{DTR}) ; port FTDI.FTDI-DTR
FTDI-EE-CLK: R87.1 U107.2(CLK) U108.62(EECLK)
FTDI-EE-CS: R88.1 U107.1(CS) U108.63(EECS)
FTDI-EE-DATA: R90.1 U107.3(DI) U108.61(EEDATA)
FTDI-GPIO0: J9.1 U108.48(DDBUS0)
FTDI-GPIO1: J9.2 U108.52(DDBUS1)
FTDI-GPIO2: J9.3 U108.53(DDBUS2)
FTDI-GPIO3: J9.4 U108.54(DDBUS3)
FTDI-GPIO4: J9.5 U108.55(DDBUS4)
FTDI-GPIO5: J9.6 U108.57(DDBUS5)
FTDI-GPIO6: J9.7 U108.58(DDBUS6)
FTDI-GPIO7: J9.8 U108.59(DDBUS7)
FTDI-RESETn: U108.22(ADBUS5) ; port FTDI.FTDI-RESETn
FTDI-RTS: U108.40(CDBUS2) U109.19(~{RTS}) ; port FTDI.FTDI-RTS
FTDI-RxD: U108.39(CDBUS1) U109.1(RXD) ; port FTDI.FTDI-RxD
FTDI-SPI-CLK: U108.26(BDBUS0) ; port FTDI.FTD-SPI-CLK
FTDI-SPI-CS: U108.29(BDBUS3) ; port FTDI.FTDI-SPI-CS
FTDI-SPI-D: U108.27(BDBUS1) ; port FTDI.FTDI-SPI-D
FTDI-SPI-HD: U108.32(BDBUS5) ; port FTDI.FTDI-SPI-HD
FTDI-SPI-Q: U108.28(BDBUS2) ; port FTDI.FTDI-SPI-Q
FTDI-SPI-WP: U108.30(BDBUS4) ; port FTDI.FTDI-SPI-WP
FTDI-TCK: U108.16(ADBUS0) ; port FTDI.FTDI-TCK
FTDI-TDI: U108.17(ADBUS1) ; port FTDI.FTDI-TDI
FTDI-TDO: U108.18(ADBUS2) ; port FTDI.FTDI-TDO
FTDI-TMS: U108.19(ADBUS3) ; port FTDI.FTDI-TMS
FTDI-TxD: U108.38(CDBUS0) U109.17(TXD) ; port FTDI.FTDI-TxD
RUSB-D_n: R28.1 U108.7(DM) U109.9(USBDM)
RUSB-D_p: R24.1 U108.8(DP) U109.8(USBDP)
USB-D_n: R28.2 ; port USB_n
USB-D_p: R24.2 ; port USB_p
NetC1_1: C1.1 C3.1 C34.1 C38.1 F5.2 U109.10(3V3OUT) U109.11(~{RESET}) U109.12(VCC) U109.20(VCCIO)
NetC10_1: C10.1 C30.1 F4.2 U108.4(VPHY)
NetC14_1: C14.1 C31.1 F3.2 U108.9(VPLL)
NetC32_1: C32.1 C33.1 C35.1 C61.1 U108.12(VCORE) U108.37(VCORE) U108.49(VREGOUT) U108.64(VCORE)
NetC36_1: C36.1 U108.2(OSCI) X2.1
NetC37_1: C37.1 U108.3(OSCO) X2.3
NetR84_2: R84.2 U108.6(REF)
NetR85_2: R85.2 U108.14(~{RESET})
NetR86_1: R86.1 R90.2 U107.4(DO)
NetR89_1: R89.1 U107.6(NC)
NetR91_1: R91.1 R92.1 U109.16(CBUS3)

Not connected (* = marked no-connect by the designer): U107 7(NC)*; U108 21(ADBUS4)* 24(ADBUS7)* 33(BDBUS6)* 34(BDBUS7)* 36(~{SUSPEND})* 45(CDBUS6)* 46(CDBUS7)* 60(~{PWREN})*; U109 2(~{RI})* 5(~{DCD})* 7(CBUS2)* 14(CBUS1)* 15(CBUS0)*

### Layout directives
differential pair; net class USB_DIFF: RUSB-D_n, RUSB-D_p, USB-D_n, USB-D_p

### Notes on the sheet
- FTDI USB-UART
- 93AA56 EEPROM 2 x 3 mm DFN package
- PIN-6: NC and ORG (pull high for 16-bit)
  PIN-9: EP termal ground
- Revision:
- Page:

### Library data of the parts
?#4 = Sub_Title_Block: as ?#3 on sheet EVK-NORA-W1_SCHEM_0001_NORA_W1_Module
C1 C3 C10 C13 C14 C20 C21 C28 C33-C35 C41 C60 C61 = 120-00016: as C2 on sheet EVK-NORA-W1_SCHEM_0001_NORA_W1_Module; Part Number: 120-00016; Revision: 0A; Supplier 1: Digi-Key; Supplier Part Number 1: 490-6297-1-ND; Manufacturer 2: Yageo; Manufacturer P/N 2: CC0402KRX5R6BB104; Supplier 2: Digi-Key; Supplier Part Number 2: 311-1336-1-ND; Arena Link: https://app.bom.com/a/GYHPV2L2L43KRMBK?v=spec.summary; Height: 0.55mm; Pins: 2; Temperature Coefficient: X5R; Voltage: 10V
C30-C32 C38 = UBXH01-0000243: as C4 on sheet EVK-NORA-W1_SCHEM_0001_NORA_W1_Module; Part Number: UBXH01-0000243; Tolerance: 20%; Max Voltage: 10V; Min Operating Temp: -40°C; Max Operating Temp: 85°C; Part Type: Capacitor; Release Data: 2021-05-10 12:57:47.325652; UBX Wiki: https://wiki.u-blox.com/bin/view/Operations/PartDetails?index=24303; RefDes: C; Mfg P/N Datasheet: https://wiki.u-blox.com/bin/view/Generic/Docs/DocumentSummary?index=24302
C36 C37 = UBXH01-0004017: as C8 on sheet EVK-NORA-W1_SCHEM_0001_NORA_W1_Module; Part Number: UBXH01-0004017; Tolerance: 5%; Max Voltage: 25V; Min Operating Temp: -55°C; Max Operating Temp: 125°C; Part Type: Capacitor; Release Data: 2009-12-03 17:48:42.813059; UBX Wiki: https://wiki.u-blox.com/bin/view/Operations/PartDetails?index=5178; RefDes: C; Manufacturer 2: Murata Manufacturing Company, Ltd.; Manufacturer P/N 2: GRM1555C1E180JZ01; Mfg P/N Status 2: Obsolete; Mfg P/N Split 2: 0; Mfg P/N Released 2: Yes; Manufacturer 3: Murata Manufacturing Company, Ltd.; Manufacturer P/N 3: GRM1555C1H180JZ01; Mfg P/N Status 3: Obsolete; Mfg P/N Split 3: 0; Mfg P/N Released 3: Yes
F3-F5 = UBXH08-0000001: FERRITE BEAD 0603 600 OHM AT 100MHZ 600OHM 500mA; Manufacturer: TDK Corporation; Manufacturer P/N: MMZ1608B601C; Editor: daniel.hurni; Released by: martin.frauchiger; Env: ROHS; Permitted Use: Support Products; Perferred: PREF; Mfg P/N Status: Active; Mfg P/N Split: 100; Mfg P/N Released: Yes; Part Number: UBXH08-0000001; Value: 600OHM; Max Current: 500mA; Min Operating Temp: -40°C; Max Operating Temp: 125°C; Part Type: Ferrite; Release Data: 2009-12-02 10:18:36.177919; UBX Wiki: https://wiki.u-blox.com/bin/view/Operations/PartDetails?index=7960; RefDes: FB; Mfg P/N Datasheet: https://wiki.u-blox.com/bin/view/Generic/Docs/DocumentSummary?index=7941
J9 = 130-00102: Socket Strip 0.1" 8 Pin 1Row SMD Black; Manufacturer 1: Seeed Technology; Manufacturer Part Number 1: Rigado 130-00102; Part Name: CON SKT Strip 0.1" 8Pin 1Row SMD Black; Item Phase: In Production; Use in new designs: Yes; Voltage: 572VDC; UBX Code: None; Part Number: 130-00102; Supplier 1: Seeed Technology; Supplier Part Number 1: Rigado 130-00102; Diameter: None; Height: 7.37mm; Max Operating Temp: 105; Min Operating Temp: -55; Pins: 8; Revision: 0C; Manufacturer 2: Samtec; Manufacturer Part Number 2: SSM-108-F-SV-P-TR; Supplier 2: Avnet; Supplier Part Number 2: SSM-108-F-SV-P-TR
R24 R28 = 180-00125: Resistor, 27ohm, 1%, 1/16W, 0402; Part Name: RES SMD 27 OHM 1% 1/16W 0402; Manufacturer: Panasonic Electronic Components; Manufacturer P/N: ERJ-2RKF27R0X; Item_Phase: Production; Component Mounting Type: SMT; Tolerance: +/- 1%; Use in new designs: Yes; Part Number: 180-00125; Part_Type: Resistor; Supplier 1: Digi-Key; Supplier Part Number 1: P27.0LCT-ND; Arena Link: https://app.bom.com/a/O6PX3ATATCBPKZ3N?v=spec.summary; Height: 0.4mm; Pins: 2; Power: 1/16W; Revision: 0C; Manufacturer 2: Samsung Electro-Mechanics America, Inc; Manufacturer P/N 2: RC1005F270CS; Supplier 2: Digi-Key; Supplier Part Number 2: 1276-3907-1-ND; Alternate Footprint Ref: RES 0402
R84 = UBXH18-0000137: RES THICK FILM CHIP 0402 12K 1% 63mW; Manufacturer: Vishay; Manufacturer P/N: CRCW040212K0FKED; Editor: matej.budin; Released by: gabriele.capello; Env: ROHS; Permitted Use: Support Products; Perferred: PREF; Mfg P/N Status: Active; Mfg P/N Split: 100; Mfg P/N Released: Yes; Part Number: UBXH18-0000137; Tolerance: 1%; Max Power: 63mW; Min Operating Temp: -55°C; Max Operating Temp: 125°C; Part Type: Resistor; Release Data: 2014-08-26 10:20:00.142219; UBX Wiki: https://wiki.u-blox.com/bin/view/Operations/PartDetails?index=21075; RefDes: R; Mfg P/N Datasheet: https://wiki.u-blox.com/bin/view/Generic/Docs/DocumentSummary?index=21077
R85 R90 = UBXH18-0008057: RES THICK FILM CHIP 0402 2K2 5% 100mW; Manufacturer: YAGEO; Manufacturer P/N: 2322_705_87222_L; Editor: roland.rust; Env: ROHS; Permitted Use: Volume Products; Perferred: PREF; Mfg P/N Status: NRND; Mfg P/N Split: 100; Mfg P/N Released: Yes; Part Number: UBXH18-0008057; Tolerance: 5%; Max Power: 100mW; Part Type: Resistor; Released by: roland.rust; Release Data: 2007-02-09 10:46:57; UBX Wiki: https://wiki.u-blox.com/bin/view/Operations/PartDetails?index=6956; RefDes: R; Manufacturer 2: YAGEO; Manufacturer P/N 2: RC0402JR-072K2L; Mfg P/N Status 2: Active; Mfg P/N Split 2: 0; Mfg P/N Released 2: Yes; Mfg P/N Datasheet 2: https://wiki.u-blox.com/bin/view/Generic/Docs/DocumentSummary?index=8163
R86-R89 R92 = UBXH18-0008073: RES THICK FILM CHIP 0402 10K 5% 100mW; Manufacturer: KOA; Manufacturer P/N: RK73B1ETTD103J; Editor: martin.frauchiger; Env: ROHS; Permitted Use: Volume Products; Perferred: PREF; Mfg P/N Status: NRND; Mfg P/N Split: 100; Mfg P/N Released: Yes; Part Number: UBXH18-0008073; Tolerance: 5%; Max Power: 100mW; Part Type: Resistor; Released by: martin.frauchiger; Release Data: 2005-08-19 10:42:45; UBX Wiki: https://wiki.u-blox.com/bin/view/Operations/PartDetails?index=6981; RefDes: R; Manufacturer 2: YAGEO; Manufacturer P/N 2: RC0402JR-0710KL; Mfg P/N Status 2: Active; Mfg P/N Split 2: 0; Mfg P/N Released 2: No; Manufacturer 3: YAGEO; Manufacturer P/N 3: 2322_705_87103_L; Mfg P/N Status 3: NRND; Mfg P/N Split 3: 0; Mfg P/N Released 3: Yes
R91 = UBXH18-0008065: RES THICK FILM CHIP 0402 4K7 5% 100mW; Manufacturer: YAGEO; Manufacturer P/N: 2322_705_70472_L; Editor: martin.frauchiger; Env: ROHS; Permitted Use: Volume Products; Perferred: PREF; Mfg P/N Status: NRND; Mfg P/N Split: 100; Mfg P/N Released: Yes; Part Number: UBXH18-0008065; Tolerance: 5%; Max Power: 100mW; Part Type: Resistor; Released by: martin.frauchiger; Release Data: 2005-08-19 10:42:45; UBX Wiki: https://wiki.u-blox.com/bin/view/Operations/PartDetails?index=6969; RefDes: R; Manufacturer 2: KOA; Manufacturer P/N 2: RK73B1ETTD472J; Mfg P/N Status 2: NRND; Mfg P/N Split 2: 0; Mfg P/N Released 2: Yes
U107 = UBXH13-0000121: EEPROM SERIAL 2KBIT 256 X 8 1.8-5.5V DFN-8PIN-2X3MM 5.5V; Mfr_Name: Microchip; Value: 93AA56AT-I/OT; Editor: hakan.ekfors; Env: ROHS; Permitted Use: Volume Products; Perferred: PREF; Mfg P/N Status: Active; Mfg P/N Split: 100; Mfg P/N Released: No; Copyright: Copyright (C) 2022 Ultra Librarian. All rights reserved.; Manufacturer_Part_Number: 93AA56AT-I/MC; Digi-Key_Part_Number_1: 93AA56AT-I/MCCT-ND; Digi-Key_Part_Number_2: 93AA56AT-I/MCDKR-ND; Digi-Key_Part_Number_3: 93AA56AT-I/MCTR-ND; RefDes: U; Type: DEV; Part Number: UBXH13-0000121; Max Voltage: 5.5V; Min Operating Temp: -40°C; Max Operating Temp: 85°C; Part Type: Memory; UBX Wiki: https://wiki.u-blox.com/bin/view/Operations/PartDetails?index=36436; Manufacturer: Microchip; Manufacturer P/N: 93AA56AT-I/OT; Mfg P/N Datasheet: https://wiki.u-blox.com/bin/view/Generic/Docs/DocumentSummary?index=20290
U108 = UBXH10-0000092: FTDI FT4232HL QUAD HIGH SPEED USB TO MULTIPURPOSE UART LQFP-64; Manufacturer: FTDI Future Technology Devices International; Editor: olof.viklund; Released by: aneeb.sohail; Env: ROHS; Permitted Use: Support Products; Perferred: PREF; Mfg P/N Status: Active; Mfg P/N Split: 100; Mfg P/N Released: No; Part Number: UBXH10-0000092; Value: FT4232HL; Min Operating Temp: -40°C; Max Operating Temp: 85°C; Part Type: Interface; Release Data: 2021-08-27 14:44:23.358237; UBX Wiki: https://wiki.u-blox.com/bin/view/Operations/PartDetails?index=35482; RefDes: U; Manufacturer P/N: FT4232HL; Mfg P/N Datasheet: https://wiki.u-blox.com/bin/view/Generic/Docs/DocumentSummary?index=16016
U109 = UBXH10-0000054: FTDI USB TO SERIAL FULL UART INTERFACE QFN20; Manufacturer: FTDI Future Technology Devices International; Editor: adam.johansson; Env: ROHS; Permitted Use: Support Products; Perferred: PREF; Mfg P/N Status: Active; Mfg P/N Split: 100; Mfg P/N Released: No; Part Number: UBXH10-0000054; Value: FT231XQ-R; Min Operating Temp: -40°C; Max Operating Temp: 85°C; Part Type: Interface; UBX Wiki: https://wiki.u-blox.com/bin/view/Operations/PartDetails?index=27258; RefDes: U; Manufacturer P/N: FT231XQ-R; Mfg P/N Datasheet: https://wiki.u-blox.com/bin/view/Generic/Docs/DocumentSummary?index=33707
X2 = 100-00006: XTAL, 4Pin, 12.0000MHz, 18pF, 20ppm, 4Pins; Manufacturer 1: Abracon LLC; Manufacturer Part Number 1: ABM8-12.000MHZ-B2-T; Part Name: XTAL 12MHz 18pF 20ppm 3225; Body Size: 3.2mm x 2.5mm; Item Phase: Unreleased; MFG Package: 4-SMD; Use in new designs: Yes; Voltage: None; Value: *; Part Number: 100-00006; Supplier 1: Digi-Key; Supplier Part Number 1: 535-9826-1-ND; Manufacturer 2: AVX Corporation; Manufacturer Part Number 2: CX3225GB12000P0HPQCC; Supplier 2: Digi-Key; Supplier Part Number 2: 1253-1168-1-ND; Height: 0.8mm; Max Operating Temp: 75; Min Operating Temp: -20; Pins: 4; Revision: None; UBX Code: None